# EAGLE design ai_breakout_ft232RL (EAGLE 7.1.0)
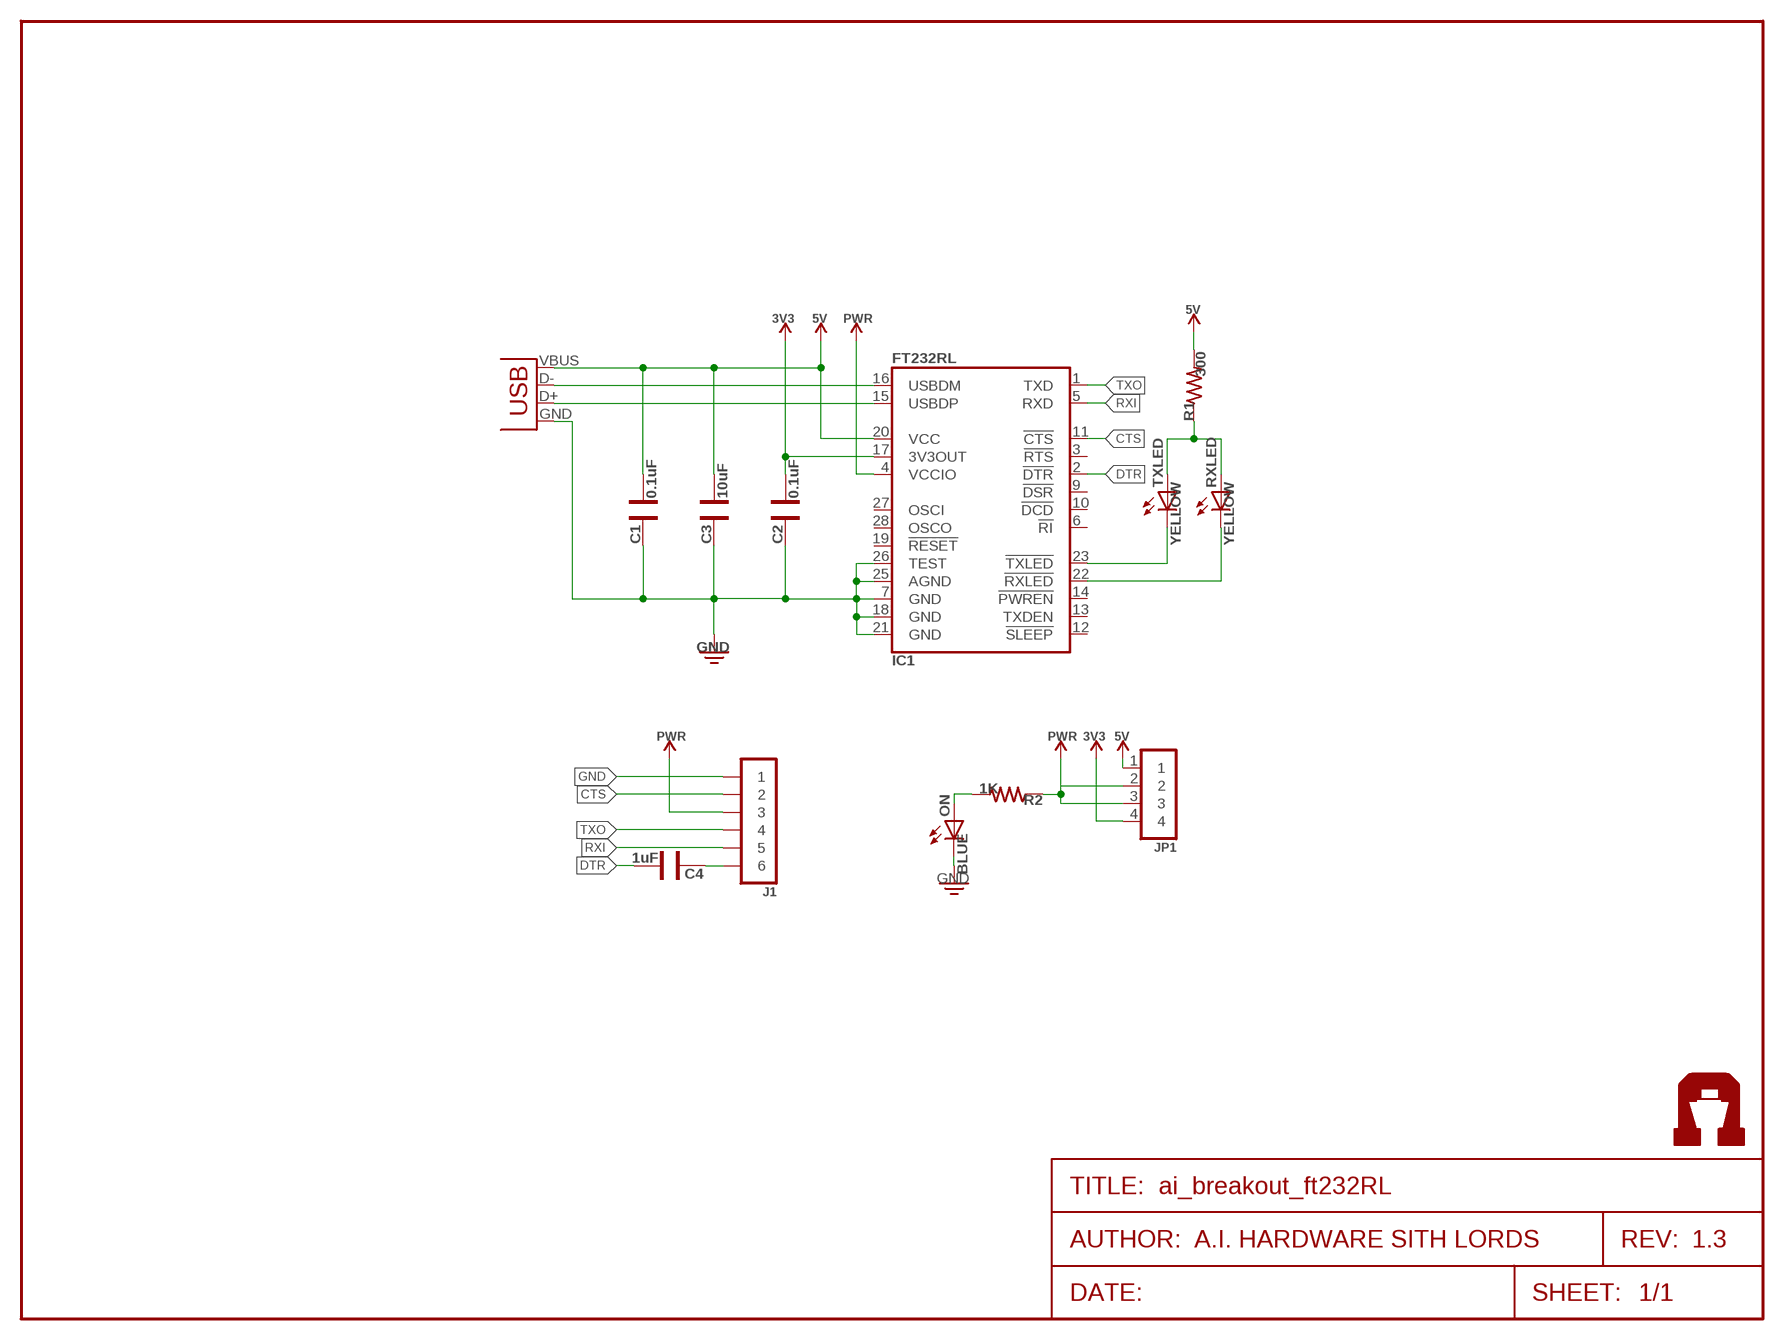
[diagram p0: schematic, sheet 1]
FRAME1 (FRAME-LETTER): AUTHOR: A.I. HARDWARE SITH LORDS; REV: 1.3

## Parts
C1  0.1uF  CAP0603  [CAP-0603]
C2  0.1uF  CAP0603  [CAP-0603]
C3  10uF  CAP0603  [CAP-0603]
C4  1uF  CAP0603  [CAP-0603]
IC1  FT2332RL  [SSOP28-LD]
J1  1X06LONG  [1X06-LONG]
JP1  1X04NOSILK  [1X04-NOSILK]
ON  BLUE  LED0603  [LED-0603]
R1  300  RES0603  [RES-0603]
R2  1K  RES0603  [RES-0603]
RXLED  YELLOW  LED0603  [LED-0603]
TXLED  YELLOW  LED0603  [LED-0603]
U$3  AI-LOGOL  [AI-LOGO-L]
USB1  USBMICROB-TH  [USB-MICROB-TH]

## Nets
3V3 [power]: C2.1 IC1.17(3V3OUT) JP1.4
5V [power]: C1.1 C3.1 IC1.20(VCC) JP1.1 R1.2 USB1.VBUS
CTS: IC1.11(!CTS) J1.2
DTR: C4.1 IC1.2(!DTR)
GND [power]: C1.2 C2.2 C3.2 IC1.7(GND) IC1.18(GND) IC1.21(GND) IC1.25(AGND) IC1.26(TEST) J1.1 ON.C USB1.GND
N$1: IC1.23(!TXLED) TXLED.C
N$2: IC1.22(!RXLED) RXLED.C
N$3: IC1.16(USBDM) USB1.D-
N$4: IC1.15(USBDP) USB1.D+
N$5: ON.A R2.2
N$6: R1.1 RXLED.A TXLED.A
N$7: C4.2 J1.6
PWR [power]: IC1.4(VCCIO) J1.3 JP1.2 JP1.3 R2.1
RXI: IC1.5(RXD) J1.5
TXO: IC1.1(TXD) J1.4
Unconnected: IC1.3(!RTS) IC1.6(!RI) IC1.9(!DSR) IC1.10(!DCD) IC1.12(!SLEEP) IC1.13(TXDEN) IC1.14(!PWREN) IC1.19(!RESET) IC1.27(OSCI) IC1.28(OSCO)

## Library data of the parts
C1-C4 = Ai_Passives:CAP
IC1 = Ai_IC:FT2332R
J1 = Ai_Connectors:1X06
JP1 = Ai_Connectors:1X04
ON RXLED TXLED = Ai_LED:LED
R1 R2 = Ai_Passives:RES: Part # blah Digikey
U$3 = Ai_Miscellany:AI-LOGO
USB1 = Ai_Connectors:USB

## Net classes
0 default: width 0.254 mm
1 power: width 0.356 mm

## Board
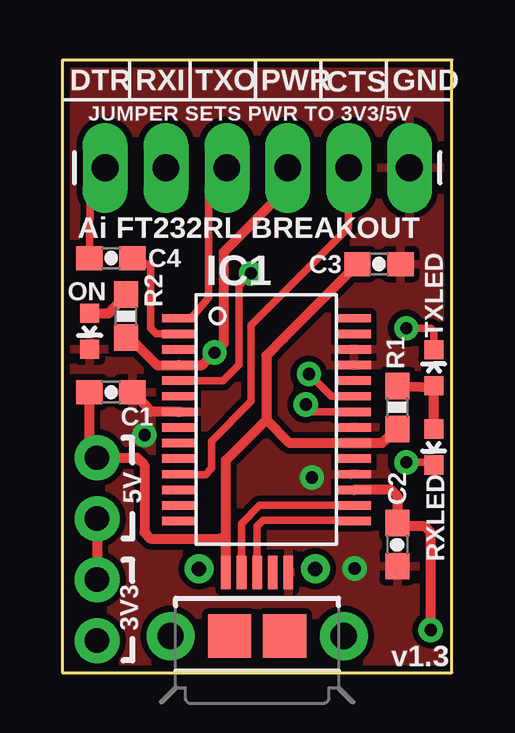
[diagram p1: board, top side]
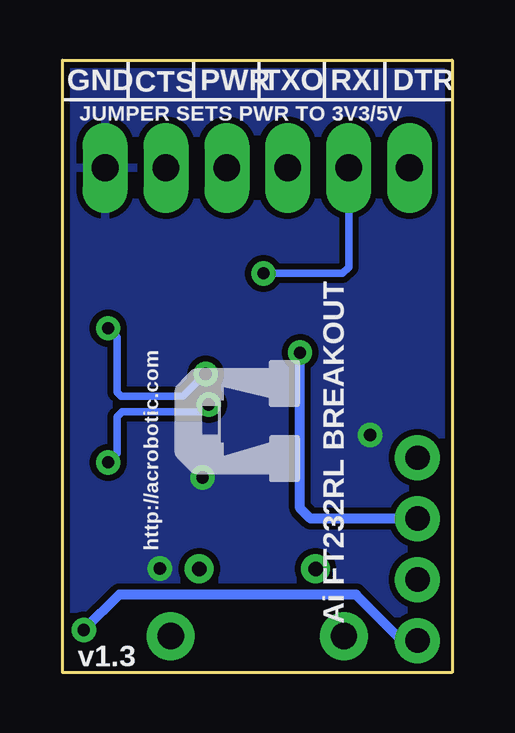
[diagram p2: board, bottom side, seen from below]

Size 16.26 x 25.53 mm. Coordinates in mm from the lower left corner, seen from the top.
Outline: 0,25.53 0,0 16.26,0 16.26,25.53 0,25.53
Copper layers (1*16): Top 0.035mm / dielectric 1.5mm / Bottom 0.035mm
Design rules "ai_2layer": minimum track width 7mil, minimum drill 15mil, track to track 8mil, track to pad 8mil, pad to pad 8mil, via to via 8mil, smd to smd 8mil, copper to edge 8mil, drill to drill 8mil, minimum pad ring 12mil, minimum via ring 10mil, stop-mask expansion 4mil, vias tented up to drill 20mil, thermal gap 10mil

### Footprints (pad centres in the part's own frame; a part is rotated, then mirrored left to right if it is on the bottom)
CAP-0603 = smd 1.1 x 1: 1 -0.9,0; 2 0.9,0
SSOP28-LD = smd 0.348 x 1.397: 1 -4.225,-3.656; 2 -3.575,-3.656; 3 -2.925,-3.656; 4 -2.275,-3.656; 5 -1.625,-3.656; 6 -0.975,-3.656; 7 -0.325,-3.656; 8 0.325,-3.656; 9 0.975,-3.656; 10 1.625,-3.656; 11 2.275,-3.656; 12 2.925,-3.656; 13 3.575,-3.656; 14 4.225,-3.656; 15 4.225,3.656; 16 3.575,3.656; 17 2.925,3.656; 18 2.275,3.656; 19 1.625,3.656; 20 0.975,3.656; 21 0.325,3.656; 22 -0.325,3.656; 23 -0.975,3.656; 24 -1.625,3.656; 25 -2.275,3.656; 26 -2.925,3.656; 27 -3.575,3.656; 28 -4.225,3.656
1X06-LONG = drill 1.118 pad 1.88 long: 1 -6.35,0; 2 -3.81,0; 3 -1.27,0; 4 1.27,0; 5 3.81,0; 6 6.35,0
1X04-NOSILK = drill 1.016 pad 1.88: 1 -3.81,0; 2 -1.27,0; 3 1.27,0; 4 3.81,0
LED-0603 = smd 0.8 x 0.8: A 0,-0.75; C 0,0.75
RES-0603 = smd 1.1 x 1: 1 -0.9,0; 2 0.9,0
USB-MICROB-TH = smd 0.4 x 1.4: D+ 0,2.65; D- -0.65,2.65; GND 1.3,2.65; ID 0.65,2.65; VBUS -1.3,2.65 | smd 1.8 x 1.8: M5 -1.15,0; M6 1.15,0 | drill 0.6 pad 1.2: MT1 -2.425,2.8; MT2 2.425,2.8 | drill 1.1 pad 2: MT3 -3.61,0; MT4 3.61,0

### Placement (x,y rotation side)
C1  2.03,11.68 0 top
C2  13.97,5.33 270 top
C3  13.21,17.02 0 top
C4  2.03,17.27 180 top
IC1  8.51,10.54 270 top
J1  8.13,21.03 180 top
JP1  1.45,5.15 270 top
ON  1.14,14.22 180 top
R1  13.97,11.05 270 top
R2  2.67,14.86 90 top
RXLED  15.49,9.4 180 top
TXLED  15.49,12.7 0 top
U$3  8.51,10.54 90 bottom
USB1  8.13,1.52 0 top

### Tracks (layer width: path | path; a pad name or v marks a point on that pad's centre or on a via)
3V3  (via drill 0.51)
  Top 0.406: v15.37,1.78 15.37,5.84 15.11,6.1 14.06,6.1 C2.1 13.97,7.37 13.72,7.62 IC1.17
  Bottom 0.406: JP1.4 2.1,1.34 4.01,3.25 13.89,3.25 v15.37,1.78
5V
  Top 0.406: USB1.VBUS 6.83,5.33 | 6.83,5.33 6.83,8.86 8.51,10.54 | 6.83,5.33 6.57,5.59 3.68,5.59 3.43,5.84 3.43,8.64 3.11,8.96 JP1.1 1.13,9.25 C1.1 | R1.2 13.34,9.57 IC1.20 9.48,9.57 8.51,10.54 | C3.1 9.23,13.93 8.51,13.21 8.51,10.54
CTS
  Top 0.305: J1.2 11.94,18.55 7.87,14.48 7.87,11.3 6.22,9.65 6.22,8.51 5.97,8.26 4.86,8.26 IC1.11
DTR
  Top 0.305: C4.1 3.56,17.02 3.68,16.89 3.68,14.35 3.92,14.12 IC1.2
GND  (via drill 0.51)
  Top 0.406: C1.2 3.7,10.87 IC1.7
  other vias: 3.43,9.91 12.19,4.34 10.41,8.13
  pour Bottom (isolate 0.254): 0,25.53 0,0 16.26,0 16.26,25.53
  pour Top (isolate 0.254): 0,25.53 0,0 16.26,0 16.26,25.53
N$1  (via drill 0.51)
  Top 0.305: 15.48,13.46 TXLED.C 15.49,14.22 15.37,14.35 v14.35,14.35 | IC1.23 11.22,11.52 v10.29,12.45
  Bottom 0.305: v14.35,14.35 13.97,13.97 13.97,11.68 13.8,11.52 11.22,11.52 v10.29,12.45
N$2  (via drill 0.51)
  Top 0.305: v14.35,8.76 15.36,8.76 RXLED.C | IC1.22 10.47,10.87 v10.16,11.18
  Bottom 0.305: v14.35,8.76 13.97,9.14 13.97,10.67 13.77,10.87 10.47,10.87 v10.16,11.18
N$3
  Top 0.305: USB1.D- 7.48,6.21 8.24,6.97 IC1.16
N$4
  Top 0.305: USB1.D+ 8.13,6.1 8.38,6.35 12.13,6.35 IC1.15
N$5
  Top 0.406: ON.A 1.93,14.97 R2.2
N$6
  Top 0.406: RXLED.A TXLED.A 15.44,11.9 R1.1
N$7
  Top 0.305: C4.2 1.18,20.43 J1.6
PWR  (via drill 0.51)
  Top 0.406: JP1.2 JP1.3 | R2.1 2.75,14.01 3.95,12.82 IC1.4 5.83,12.82 v6.35,13.34 6.73,13.72 6.73,17.53 9.4,20.2 J1.3
  Bottom 0.406: JP1.2 5.91,6.42 6.35,6.86 v6.35,13.34
RXI  (via drill 0.51)
  Top 0.305: v7.87,16.64 7.37,16.13 7.37,12.83 6.71,12.17 IC1.5
  Bottom 0.305: v7.87,16.64 4.57,16.64 4.32,16.89 J1.5
TXO
  Top 0.305: J1.4 6.1,20.27 6.1,15.62 5.37,14.77 IC1.1

### Text on the board
tPlace: DTR | RXI | TXO | PWR | CTS | GND | JUMPER SETS PWR TO 3V3/5V | Ai FT232RL BREAKOUT | 5V | 3V3 | v1.3
bPlace: DTR | RXI | TXO | PWR | CTS | GND | JUMPER SETS PWR TO 3V3/5V | http://acrobotic.com | Ai FT232RL BREAKOUT | v1.3
_tsilk: Ai FT232RL BREAKOUT | v1.0 | DTR | RXI | R1 | TXLED | TXO | RXLED | R2 | PWR | R3 | CTS | 3V3 | PWR | PWR | 5V | GND | Jumper sets PWR to 3V3/5V | 5V | 3V3
_bsilk: C1 | C2 | /home/xisco/ai_logo.bmp | R4